# EasyEDA Pro project STM32F743ucosiii_lg.eprj, schematic 游戏主板_V2505
Board Name: 游戏主板_V2505; Create Date: 2025-06-09; Page Name: 游戏主板_V2505; Project Name: STM32F743ucosiii_lg; Schematic Name: 游戏主板_V2505; Update Date: 2025-06-09
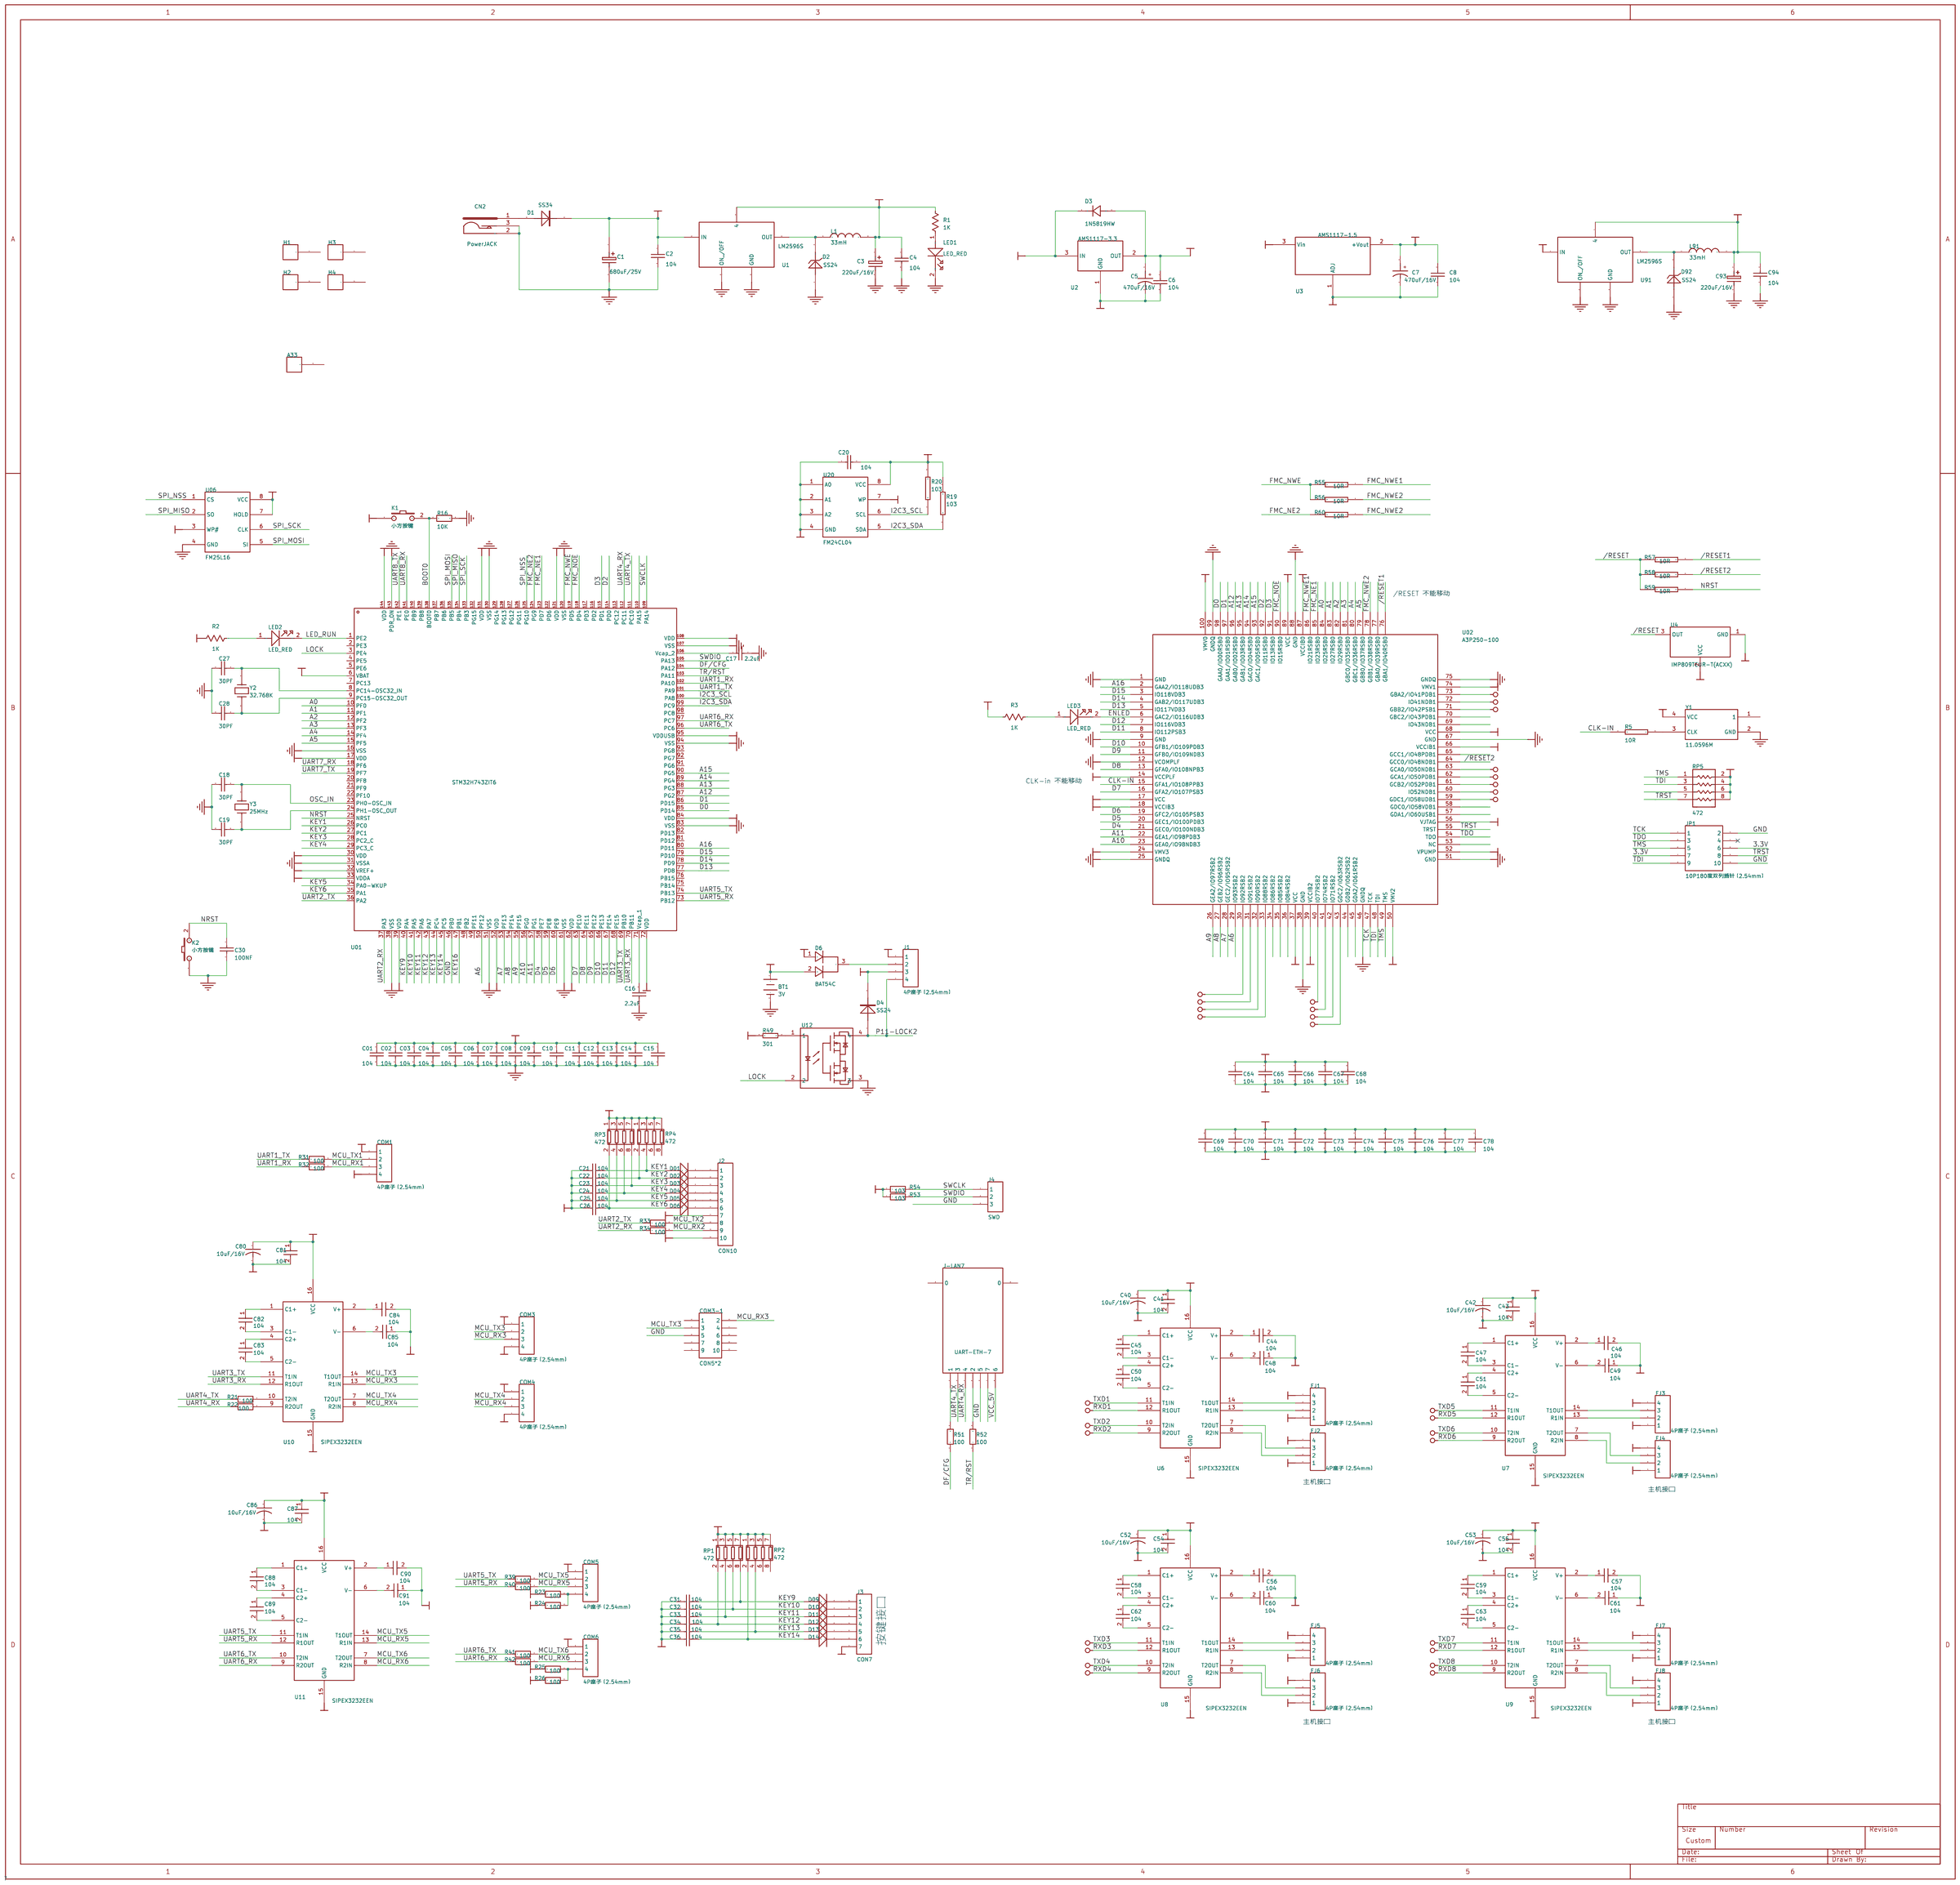
[diagram p0: schematic sheet]

## Parts
A33  TP  [A33安卓小板]
BT1  3V  [BATTERY_CR2032]
C01  104  [0805]
C1  680uF/25V  [EC_SMD_8*6]
C02  104  [0805]
C2  104  [0805]
C03  104  [0805]
C3  220uF/16V  [EC_SMD_8*6]
C04  104  [0805]
C4  104  [0805]
C5  470uF/16V  [EC_SMD_8*6]
C05  104  [0805]
C6  104  [C0805]
C06  104  [0805]
C7  470uF/16V  [EC_SMD_8*6]
C07  104  [0805]
C8  104  [C0805]
C08  104  [0805]
C09  104  [0805]
C10  104  [0805]
C11  104  [0805]
C12  104  [0805]
C13  104  [0805]
C14  104  [0805]
C15  104  [0805]
C16  2.2uF  [0805]
C17  2.2uF  [0805]
C18  30PF  [0805]
C19  30PF  [0805]
C20  104  [0805]
C21  104  [C0805]
C22  104  [C0805]
C23  104  [C0805]
C24  104  [C0805]
C25  104  [C0805]
C26  104  [C0805]
C27  30PF  [0805]
C28  30PF  [0805]
C30  100NF  [0805]
C31  104  [0805]
C32  104  [0805]
C33  104  [0805]
C34  104  [0805]
C35  104  [0805]
C36  104  [0805]
C40  10uF/16V  [EC_SMD_4*5.3]
C41  104  [C0805]
C42  10uF/16V  [EC_SMD_4*5.3]
C43  104  [C0805]
C44  104  [C0805]
C45  104  [C0805]
C46  104  [C0805]
C47  104  [C0805]
C48  104  [C0805]
C49  104  [C0805]
C50  104  [C0805]
C51  104  [C0805]
C52  10uF/16V  [EC_SMD_4*5.3]
C53  10uF/16V  [EC_SMD_4*5.3]
C54  104  [C0805]
C55  104  [C0805]
C56  104  [C0805]
C57  104  [C0805]
C58  104  [C0805]
C59  104  [C0805]
C60  104  [C0805]
C61  104  [C0805]
C62  104  [C0805]
C63  104  [C0805]
C64  104  [0805]
C65  104  [C0805]
C66  104  [C0805]
C67  104  [C0805]
C68  104  [C0805]
C69  104  [C0805]
C70  104  [C0805]
C71  104  [C0805]
C72  104  [C0805]
C73  104  [C0805]
C74  104  [C0805]
C75  104  [C0805]
C76  104  [C0805]
C77  104  [C0805]
C78  104  [C0805]
C80  10uF/16V  [EC_SMD_4*5.3]
C81  104  [0805]
C82  104  [0805]
C83  104  [0805]
C84  104  [0805]
C85  104  [0805]
C86  10uF/16V  [EC_SMD_4*5.3]
C87  104  [0805]
C88  104  [0805]
C89  104  [0805]
C90  104  [0805]
C91  104  [0805]
C93  220uF/16V  [EC_SMD_8*6]
C94  104  [0805]
CN2  PowerJACK  [POWER_DC12V]
COM1  4P座子（2.54mm）  [4SIP4]
COM3  4P座子（2.54mm）  [4SIP4]
COM3-1  CON5*2  [JYNJ_10]
COM4  4P座子（2.54mm）  [4SIP4]
COM5  4P座子（2.54mm）  [4SIP4]
COM6  4P座子（2.54mm）  [4SIP4]
D1  SS34  [SOD-1808]
D01  4148  [SOD-123]
D2  SS24  [SOD-1808]
D02  4148  [SOD-123]
D3  1N5819HW  [SOD-1808]
D03  4148  [SOD-123]
D04  4148  [SOD-123]
D4  SS24  [SOD-1808]
D05  4148  [SOD-123]
D06  4148  [SOD-123]
D6  BAT54C  [BAT54C]
D09  4148  [SOD-123]
D10  4148  [SOD-123]
D11  4148  [SOD-123]
D12  4148  [SOD-123]
D13  4148  [SOD-123]
D14  4148  [SOD-123]
D92  SS24  [SOD-1808]
FJ1  4P座子（2.54mm）  [4SIP4]
FJ2  4P座子（2.54mm）  [4SIP4]
FJ3  4P座子（2.54mm）  [4SIP4]
FJ4  4P座子（2.54mm）  [4SIP4]
FJ5  4P座子（2.54mm）  [4SIP4]
FJ6  4P座子（2.54mm）  [4SIP4]
FJ7  4P座子（2.54mm）  [4SIP4]
FJ8  4P座子（2.54mm）  [4SIP4]
H1  TP  [HOLE_6MM_3MM5]
H2  TP  [HOLE_6MM_3MM5]
H3  TP  [HOLE_6MM_3MM5]
H4  TP  [HOLE_6MM_3MM5]
J1  4P座子（2.54mm）  [4SIP4]
J2  CON10  [SIP10(2.54)]
J3  CON7  [SIP7(2.54)]
J4  SWD  [4SIP3]
J-LAN7  UART-ETH-7  [UART-ETH-7]
JP1  10P180度双列插针（2.54mm）  [JYNJ_10]
K1  小方按键  [4KEY-2]
K2  小方按键  [4KEY-2]
L1  33mH  [DG220]
L91  33mH  [DG220]
LED1  LED_RED  [LED-0805]
LED2  LED_RED  [LED-0805]
LED3  LED_RED  [LED-0805]
R1  1K  [0805]
R2  1K  [0805]
R3  1K  [0805]
R5  10R  [0805]
R16  10K  [0805]
R19  103  [0805]
R20  103  [0805]
R21  10K  [0805]
R22  10K  [0805]
R23  10K  [0805]
R24  10K  [0805]
R25  10K  [0805]
R26  10K  [0805]
R31  10K  [0805]
R32  10K  [0805]
R33  10K  [0805]
R34  10K  [0805]
R39  10K  [0805]
R40  10K  [0805]
R41  10K  [0805]
R42  10K  [0805]
R49  301  [0805]
R51  10K  [0805]
R52  10K  [0805]
R53  10K  [0805]
R54  10K  [0805]
R55  10R  [0805]
R56  10R  [0805]
R57  10R  [0805]
R58  10R  [0805]
R59  10R  [0805]
R60  10R  [0805]
RP1  472  [0603-8P4R]
RP2  472  [0603-8P4R]
RP3  472  [0603-8P4R]
RP4  472  [0603-8P4R]
RP5  472  [0603-8P4R]
U01  STM32H743ZIT6  [STM32H743-LQFP-144]
U1  LM2596S  [TO-263]
U02  A3P250-100  [A3P250-LQFP100]
U2  AMS1117-3.3  [LM1117-3.3]
U3  AMS1117-1.5  [LM1117-3.3]
U4  IMP809TEUR-T(ACXX)  [809T]
U6  SIPEX3232EEN  [SIPEX3232EEN]
U06  FM25L16  [SOIC-8_L5.3-W5.3-P1.27-LS8.0-BL]
U7  SIPEX3232EEN  [SIPEX3232EEN]
U8  SIPEX3232EEN  [SIPEX3232EEN]
U9  SIPEX3232EEN  [SIPEX3232EEN]
U10  SIPEX3232EEN  [SIPEX3232EEN]
U11  SIPEX3232EEN  [SIPEX3232EEN]
U12  GAQY211G2S  [固态继电器SOP-4]
U20  FM24CL04  [SO-8]
U91  LM2596S  [TO-263]
Y1  11.0596M  [OSC-SMD4P-11.0592M]
Y2  32.768K  [OSC-SMD2P-32.768K]
Y3  25MHz  [OSC-SMD2P_25M]

## Library data of the parts
A33 H1-H4 = TP: Library Name: *
BT1 = BATTERY: Library Name: A20_BOARD_V1
C01 = CAP: 贴片电容; Origin Footprint 3: CAP0805; Library Name: 常用
C1 = ELECTRO1: Electrolytic Capacitor; Library Name: *
C02 C03 C04 C05 C06 C07 C08 C09-C17 = CAP: 贴片电容; Origin Footprint 2: CAP0805; Origin Footprint 3: C0805; Library Name: 常用
C2 C4 C20 C94 = CAP: 电容; Origin Footprint 2: RAD0.2; Library Name: *
C3 C93 = ELECTRO1: 电解电容; Origin Footprint 2: RB-.1/.2; Library Name: *
C5 C7 = CAPACITOR POL: Library Name: A20_BOARD_V1
C6 C8 = CAP: Capacitor; Origin Footprint 2: 0805; Origin Footprint 3: CAP0805; Library Name: A20_BOARD_V1
C18 C19 C27 C28 C30 = CAP: Capacitor; Origin Footprint 2: 0603; Origin Footprint 3: 0402; Library Name: *
C21-C26 C65-C78 = CAP: Capacitor; Origin Footprint 2: 0805; Origin Footprint 3: CAP0805; Library Name: *
C31-C36 C64 = CAP: Capacitor; Origin Footprint 2: CAP0805; Origin Footprint 3: C0805; Library Name: *
C40 C42 C52 C53 C80 C86 = CAP_1: Text Field1: 20; Text Field2: 10; Origin Footprint 2: RB-.1/.2; Origin Footprint 3: RB-.1/.2; Library Name: COM
C41 C43 C45 C47 C50 C51 C54 C55 C58 C59 C62 C63 = CAP NP_2: Text Field1: 20; Text Field2: 10; Origin Footprint 2: 0805; Origin Footprint 3: CAP0805; Library Name: *
C44 C46 C48 C49 C56 C57 C60 C61 = CAP NP_1: Text Field1: 20; Text Field2: 10; Origin Footprint 2: 0805; Origin Footprint 3: CAP0805; Library Name: *
C81-C83 C87-C89 = CAP NP_2: Text Field1: 20; Text Field2: 10; Origin Footprint 2: CAP0805; Origin Footprint 3: C0805; Library Name: *
C84 C85 C90 C91 = CAP NP_1: Text Field1: 20; Text Field2: 10; Origin Footprint 2: CAP0805; Origin Footprint 3: C0805; Library Name: *
CN2 = PowerJACK: Library Name: A20_BOARD_V1
COM1 COM3-COM6 FJ1-FJ8 J1 = CON4: Connector; Library Name: *
COM3-1 = CON5*2: 10P180度插座（2.54mm）; Library Name: XXLG
D1 D4 = DIODE: 二极管; Origin Footprint 2: DIODE0.3; Origin Footprint 3: DIODE0.4; Origin Footprint 4: DIODE0.7; Library Name: *
D01 D02 D03 D04 D05 D06 D09-D14 = Diode 1N4148: High Conductance Fast Diode; Published: 8-Jun-2000; LatestRevisionDate: 17-Jul-2002; LatestRevisionNote: Re-released for DXP Platform.; DatasheetDocument: 1997; PackageReference: DO-35; Publisher: Altium Limited; Code_JEDEC: DO-204-AH; ComponentLink1Description: Manufacturer Link; ComponentLink1URL: http://www.fairchildsemi.com/; ComponentLink2Description: Datasheet; ComponentLink2URL: http://www.fairchildsemi.com/ds/1N%2F1N4148.pdf; Library Name: Miscellaneous Devices; Datasheet: http://www.fairchildsemi.com/ds/1N%2F1N4148.pdf
D2 D92 = ZENER3: Zener Diode; Library Name: *
D3 = DIODE: Library Name: A20_BOARD_V1
D6 = BAT54C_C2135: Supplier Part: C2135; Supplier Footprint: SOT-23; JLCPCB Part Class: Extended Part; Datasheet: https://atta.szlcsc.com/upload/public/pdf/source/20140809/1457707206468.pdf; Supplier: LCSC; Forward Voltage (Vf@If): 1V@100mA; Reverse Voltage (Vr): 30V; Average Rectified Current (Io): 200mA; Library Name: XX_SWJX_1
J2 = CON10: 10P180度插座（2.54mm）; Library Name: XXLG
J3 = CON7: 10P180度插座（2.54mm）; Library Name: XXLG
J4 = CON3: Connector; Library Name: XXLG
J-LAN7 = UART-ETH_1: 8P串口转网口; Library Name: XXLG
JP1 = HEADER 5X2: Library Name: *
K1 K2 = SW-PB: 小方按键6*6; Library Name: 常用
L1 L91 = INDUCTOR: Library Name: *
LED1-LED3 = LED_0: Library Name: *
R1-R3 = R_Generic: P/N #1: CR10-1001F-T; TOL: 5%; VAL: 1R; REF: RC0603JR-071RL; FAB: YAGEO; DEV: R0603; DESIG: RC21 5%; BOI: 0603; Library Name: *
R5 R19 R20 R55-R60 = RES2: Library Name: *
R16 = Res2: Resistor; Published: 8-Jun-2000; LatestRevisionDate: 17-Jul-2002; LatestRevisionNote: Re-released for DXP Platform.; PackageReference: AXIAL-0.4; Publisher: Altium Limited; Origin Footprint 2: 0603; Origin Footprint 3: 0402; Library Name: Miscellaneous Devices
R21-R26 R31-R34 R39-R42 R53 R54 = Res2: Resistor; Published: 8-Jun-2000; LatestRevisionDate: 17-Jul-2002; LatestRevisionNote: Re-released for DXP Platform.; PackageReference: AXIAL-0.4; Publisher: Altium Limited; Origin Footprint 2: 0603; Origin Footprint 3: 0402; Design Item ID: RES2; Library Name: Miscellaneous Devices
R49 = R: Origin Footprint 2: AXIAL0.4; Origin Footprint 3: 1210; Origin Footprint 4: RES-1206; Origin Footprint 5: RES-0805; Library Name: XX_SWJX_1
R51 R52 = Res2: Resistor; Published: 8-Jun-2000; LatestRevisionDate: 17-Jul-2002; LatestRevisionNote: Re-released for DXP Platform.; PackageReference: AXIAL-0.4; Publisher: Altium Limited; Design Item ID: RES2; Library Name: Miscellaneous Devices
RP1-RP4 = RES4: Library Name: *
RP5 = RESPACK5: 贴片排阻; Library Name: 常用分立器件
U01 = STM32H743ZIT6: Supplier Part: C114408; Supplier Footprint: LQFP-144(20x20); JLCPCB Part Class: Extended Part; Datasheet: https://atta.szlcsc.com/upload/public/pdf/source/20180326/C129442_D4CD7A13251C79DE4F637D238512E0C6.pdf; Supplier: LCSC; Program Storage Size: 2MB; RAM Size: 1MB; GPIO Ports Number: 114; Operating Voltage Range: 1.62V~3.6V; CPU Maximum Speed: 480MHz; Program Memory Type: FLASH; ADC (Bit): 16bit; DAC (Bit): 12bit
U1 U91 = LM2596S: 电源芯片; Library Name: *
U02 = A3P250-100: Library Name: 常用IC
U2 = LM1117: Library Name: A20_BOARD_V1
U3 = LM117T: Origin Footprint 2: TO220H; Library Name: A20_BOARD_V1
U4 = IMP809: Library Name: 常用分立器件
U6-U11 = Sipex3232: Library Name: A20_pcb
U06 = FM25L16: Library Name: XX_SWJX_1
U12 = GAQY211G2S: Supplier Part: C7435104; Supplier Footprint: SOP-4; JLCPCB Part Class: Extended Part; Datasheet: https://atta.szlcsc.com/upload/public/pdf/source/20240823/3547E741FC2EB9AE5E041DA54A858D67.pdf; Supplier: LCSC; Input Forward Voltage: 1.2V; Voltage - Load: 40V; Continuous Load Current: 2.5A; Isolation Voltage(rms): 2.5kV; Turn-on time: 800us; Turn-off time: 20us; Library Name: XX_SWJX_1
U20 = 24C04: Library Name: *
Y1 = CRYSTAL1: X?; Library Name: *
Y2 Y3 = CRYSTAL: Crystal; Library Name: 常用分立器件

## Nets
1.5V: C7.1 C8.1 C64.2 C65.2 C66.1 C67.1 C68.1 U02.14(VCCPLF) U02.17(VCC) U02.37(VCC) U02.68(VCC) U02.89(VCC) U3.2(+Vout)
3.3V: C01.1 C02.1 C03.1 C04.1 C5.1 C05.1 C6.1 C06.1 C07.1 C08.1 C09.1 C10.1 C11.1 C12.1 C13.1 C14.1 C15.1 C20.2 C40.1 C41.1 C42.1 C43.1 C52.1 C53.1 C54.1 C55.1 C69.1 C70.1 C71.1 C72.1 C73.1 C74.1 C75.1 C76.1 C77.1 C78.1 C80.1 C81.1 C86.1 C87.1 D3.1(ANODE) D6.1(A1) JP1.6 JP1.7 K1.1 R2.1 R3.1 R19.2 R20.2 R49.2 R53.1 R54.1 RP1.1 RP1.3 RP1.5 RP1.7 RP2.1 RP2.3 RP2.5 RP2.7 RP3.1 RP3.3 RP3.5 RP3.7 RP4.1 RP4.3 RP4.5 RP4.7 RP5.2 RP5.4 RP5.6 RP5.8 U01.17(VDD) U01.30(VDD) U01.32(VREF+) U01.33(VDDA) U01.39(VDD) U01.52(VDD) U01.62(VDD) U01.72(VDD) U01.84(VDD) U01.95(VDDUSB) U01.108(VDD) U01.121(VDD) U01.131(VDD) U01.144(VDD) U2.2(OUT) U02.18(VCCIB3) U02.24(VMV3) U02.39(VCCIB2) U02.50(VMV2) U02.52(VPUMP) U02.56(VJTAG) U02.66(VCCIB1) U02.74(VMV1) U02.87(VCCIB0) U02.100(VMV0) U4.2(VCC) U06.3(WP#) U06.7(HOLD) U06.8(VCC) U6.16(VCC) U7.16(VCC) U8.16(VCC) U9.16(VCC) U10.16(VCC) U11.16(VCC) U20.8(VCC) Y1.4(VCC)
GND: BT1.2(-) C01.2 C1.2 C02.2 C2.2 C03.2 C3.2 C04.2 C4.2 C5.2 C05.2 C6.2 C06.2 C7.2 C07.2 C8.2 C08.2 C09.2 C10.2 C11.2 C12.2 C13.2 C14.2 C15.2 C16.2 C17.2 C18.1 C19.1 C20.1 C21.2 C22.2 C23.2 C24.2 C25.2 C26.2 C27.1 C28.1 C30.2 C31.2 C32.2 C33.2 C34.2 C35.2 C36.2 C40.2 C41.2 C42.2 C43.2 C44.2 C46.2 C48.1 C49.1 C52.2 C53.2 C54.2 C55.2 C56.2 C57.2 C60.1 C61.1 C64.1 C65.1 C66.2 C67.2 C68.2 C69.2 C70.2 C71.2 C72.2 C73.2 C74.2 C75.2 C76.2 C77.2 C78.2 C80.2 C81.2 C84.2 C85.1 C86.2 C87.2 C90.2 C91.1 C93.2 C94.2 CN2.2 CN2.3 COM1.1 COM3.1 COM3.4 COM3-1.5 COM4.1 COM4.4 COM5.1 COM6.1 D2.1(A) D92.1(A) FJ1.1 FJ1.4 FJ2.1 FJ2.4 FJ3.1 FJ3.4 FJ4.1 FJ4.4 FJ5.1 FJ5.4 FJ6.1 FJ6.4 FJ7.1 FJ7.4 FJ8.1 FJ8.4 J2.7 J3.7 J4.3 J-LAN7.5 JP1.2 JP1.10 K2.1 LED1.2(CATHODE) R16.2 R23.1 R25.1 U1.3(GND) U1.5(ON /OFF) U01.16(VSS) U01.31(VSSA) U01.38(VSS) U01.46(PB0) U01.51(VSS) U01.61(VSS) U01.83(VSS) U01.94(VSS) U01.107(VSS) U01.120(VSS) U01.130(VSS) U01.143(PDR_ON) U02.1(GND) U2.1(GND) U02.9(GND) U02.12(VCOMPLF) U02.25(GNDQ) U02.38(GND) U02.46(GNDQ) U02.51(GND) U02.67(GND) U02.75(GNDQ) U02.88(GND) U02.99(GNDQ) U3.1(ADJ) U4.1(GND) U06.4(GND) U6.15(GND) U7.15(GND) U8.15(GND) U9.15(GND) U10.15(GND) U11.15(GND) U12.3 U20.1(A0) U20.2(A1) U20.3(A2) U20.4(GND) U20.7(WP) U91.3(GND) U91.5(ON /OFF) Y1.2(GND)
V12: C1.1 C2.1 D1.2(K) D4.2(K) J1.3 U1.1(IN) U91.1(IN)
VCC_5V: C3.1 C4.1 D3.2(CATHODE) J2.10 J-LAN7.6 L1.2 R1.1 R24.1 R26.1 U1.4 U2.3(IN) U3.3(Vin)
/RESET: R57.1 R58.1 R59.1 U4.3(OUT)
/RESET1: R57.2 U02.76(GBA1/IO40RSB0)
/RESET2: R58.2 U02.64(GCC0/IO48NDB1)
A0: U01.10(PF0) U02.84(IO25RSB0)
A1: U01.11(PF1) U02.83(IO27RSB0)
A2: U01.12(PF2) U02.82(IO29RSB0)
A3: U01.13(PF3) U02.81(GBC0/IO35RSB0)
A4: U01.14(PF4) U02.80(GBC1/IO36RSB0)
A5: U01.15(PF5) U02.79(GBB0/IO37RSB0)
A6: U01.50(PF12) U02.29(IO93RSB2)
A7: U01.53(PF13) U02.28(GEC2/IO95RSB2)
A8: U01.54(PF14) U02.27(GEB2/IO96RSB2)
A9: U01.55(PF15) U02.26(GEA2/IO97RSB2)
A10: U01.56(PG0) U02.23(GEA0/IO98NDB3)
A11: U01.57(PG1) U02.22(GEA1/IO98PDB3)
A12: U01.87(PG2) U02.96(GAB0/IO02RSB0)
A13: U01.88(PG3) U02.95(GAB1/IO03RSB0)
A14: U01.89(PG4) U02.94(GAC0/IO04RSB0)
A15: U01.90(PG5) U02.93(GAC1/IO05RSB0)
A16: U01.80(PD11) U02.2(GAA2/IO118UDB3)
A33_5V: C93.1 C94.1 COM1.4 L91.2 U91.4
BOOT0: K1.2 R16.1 U01.138(BOOT0)
CLK-IN: R5.1 U02.15(GFA1/IO108PPB3)
D0: U01.85(PD14) U02.98(GAA0/IO00RSB0)
D1: U01.86(PD15) U02.97(GAA1/IO01RSB0)
D2: U01.114(PD0) U02.92(IO11RSB0)
D3: U01.115(PD1) U02.91(IO13RSB0)
D4: U01.58(PE7) U02.21(GEC0/IO100NDB3)
D5: U01.59(PE8) U02.20(GEC1/IO100PDB3)
D6: U01.60(PE9) U02.19(GFC2/IO105PSB3)
D7: U01.63(PE10) U02.16(GFA2/IO107PSB3)
D8: U01.64(PE11) U02.13(GFA0/IO108NPB3)
D9: U01.65(PE12) U02.11(GFB0/IO109NDB3)
D10: U01.66(PE13) U02.10(GFB1/IO109PDB3)
D11: U01.67(PE14) U02.8(IO112PSB3)
D12: U01.68(PE15) U02.7(IO116VDB3)
D13: U01.77(PD8) U02.5(IO117VDB3)
D14: U01.78(PD9) U02.4(GAB2/IO117UDB3)
D15: U01.79(PD10) U02.3(IO118VDB3)
DF/CFG: R51.1 U01.104(PA12)
ENLED: LED3.2(CATHODE) U02.6(GAC2/IO116UDB3)
FMC_NE1: U01.123(PD7) U02.85(IO23RSB0)
FMC_NE2: R60.1 U01.124(PG9)
FMC_NOE: U01.118(PD4) U02.90(IO15RSB0)
FMC_NWE: R55.1 R56.1 U01.119(PD5)
FMC_NWE1: R55.2 U02.86(IO21RSB0)
FMC_NWE2: R56.2 R60.2 U02.78(GBB1/IO38RSB0)
I2C3_SCL: R20.1 U01.100(PA8) U20.6(SCL)
I2C3_SDA: R19.1 U01.99(PC9) U20.5(SDA)
KEY1: C21.1 D01.1(2) RP4.4 U01.26(PC0)
KEY2: C22.1 D02.1(2) RP4.2 U01.27(PC1)
KEY3: C23.1 D03.1(2) RP3.8 U01.28(PC2_C)
KEY4: C24.1 D04.1(2) RP3.6 U01.29(PC3_C)
KEY5: C25.1 D05.1(2) RP3.4 U01.34(PA0-WKUP)
KEY6: C26.1 D06.1(2) RP3.2 U01.35(PA1)
KEY9: C31.1 D09.1(2) RP1.8 U01.40(PA4)
KEY10: C32.1 D10.1(2) RP1.6 U01.41(PA5)
KEY11: C33.1 D11.1(2) RP1.4 U01.42(PA6)
KEY12: C34.1 D12.1(2) RP1.2 U01.43(PA7)
KEY13: C35.1 D13.1(2) RP2.4 U01.44(PC4)
KEY14: C36.1 D14.1(2) RP2.2 U01.45(PC5)
KEY16: U01.47(PB1)
LED_RUN: LED2.2(CATHODE) U01.1(PE2)
LOCK: U01.3(PE4) U12.2
MCU_RX1: COM1.3 R32.2
MCU_RX2: J2.9 R34.2
MCU_RX3: COM3.3 COM3-1.2 U10.13(R1IN)
MCU_RX4: COM4.3 U10.8(R2IN)
MCU_RX5: COM5.3 R40.2 U11.13(R1IN)
MCU_RX6: COM6.3 R42.2 U11.8(R2IN)
MCU_TX1: COM1.2 R31.2
MCU_TX2: J2.8 R33.2
MCU_TX3: COM3.2 COM3-1.3 U10.14(T1OUT)
MCU_TX4: COM4.2 U10.7(T2OUT)
MCU_TX5: COM5.2 R39.2 U11.14(T1OUT)
MCU_TX6: COM6.2 R41.2 U11.7(T2OUT)
NRST: C30.1 K2.2 R59.2 U01.25(NRST)
OSC_IN: C18.2 U01.23(PH0-OSC_IN) Y3.2
P11-LOCK2: D4.1(A) J1.4 U12.4
RXD1: U02.30(IO92RSB2) U6.12(R1OUT)
RXD2: U02.33(IO88RSB2) U6.9(R2OUT)
RXD3: U02.59(GDC1/IO58UDB1) U8.12(R1OUT)
RXD4: U02.62(GCA1/IO50PDB1) U8.9(R2OUT)
RXD5: U02.40(IO77RSB2) U7.12(R1OUT)
RXD6: U02.43(GDC2/IO63RSB2) U7.9(R2OUT)
RXD7: U02.63(GCA0/IO50NDB1) U9.12(R1OUT)
RXD8: U02.73(GBA2/IO41PDB1) U9.9(R2OUT)
SPI_MISO: U01.134(PB4) U06.2(SO)
SPI_MOSI: U01.135(PB5) U06.5(SI)
SPI_NSS: U01.125(PG10) U06.1(CS)
SPI_SCK: U01.133(PB3) U06.6(CLK)
SWCLK: J4.1 R54.2 U01.109(PA14)
SWDIO: J4.2 R53.2 U01.105(PA13)
TCK: JP1.1 U02.47(TCK)
TDI: JP1.9 RP5.3 U02.48(TDI)
TDO: JP1.3 U02.54(TDO)
TMS: JP1.5 RP5.1 U02.49(TMS)
TR/RST: R52.1 U01.103(PA11)
TRST: JP1.8 RP5.7 U02.55(TRST)
TXD1: U02.31(IO91RSB2) U6.11(T1IN)
TXD2: U02.32(IO90RSB2) U6.10(T2IN)
TXD3: U02.60(IO52NDB1) U8.11(T1IN)
TXD4: U02.61(GCB2/IO52PDB1) U8.10(T2IN)
TXD5: U02.41(IO74RSB2) U7.11(T1IN)
TXD6: U02.42(IO71RSB2) U7.10(T2IN)
TXD7: U02.71(GBB2/IO42PSB1) U9.11(T1IN)
TXD8: U02.72(IO41NDB1) U9.10(T2IN)
UART1_RX: R32.1 U01.102(PA10)
UART1_TX: R31.1 U01.101(PA9)
UART2_RX: R34.1 U01.37(PA3)
UART2_TX: R33.1 U01.36(PA2)
UART3_RX: U01.70(PB11) U10.12(R1OUT)
UART3_TX: U01.69(PB10) U10.11(T1IN)
UART4_RX: J-LAN7.4 R22.1 U01.112(PC11)
UART4_TX: J-LAN7.3 R21.1 U01.111(PC10)
UART5_RX: R40.1 U01.73(PB12) U11.12(R1OUT)
UART5_TX: R39.1 U01.74(PB13) U11.11(T1IN)
UART6_RX: R42.1 U01.97(PC7) U11.9(R2OUT)
UART6_TX: R41.1 U01.96(PC6) U11.10(T2IN)
UART7_RX: U01.18(PF6)
UART7_TX: U01.19(PF7)
UART8_RX: U01.141(PE0)
UART8_TX: U01.142(PE1)
V-BAT: J1.1 U01.6(VBAT)
V-BT1: BT1.1(+) D6.2(A2)
NETC16_1: C16.1 U01.71(Vcap_1)
NETC17_1: C17.1 U01.106(Vcap_2)
NETC19_2: C19.2 U01.24(PH1-OSC_OUT) Y3.1
NETC27_2: C27.2 U01.8(PC14-OSC32_IN) Y2.2
NETC28_2: C28.2 U01.9(PC15-OSC32_OUT) Y2.1
NETC44_1: C44.1 U6.2(V+)
NETC45_1: C45.1 U6.1(C1+)
NETC45_2: C45.2 U6.3(C1-)
NETC46_1: C46.1 U7.2(V+)
NETC47_1: C47.1 U7.1(C1+)
NETC47_2: C47.2 U7.3(C1-)
NETC48_2: C48.2 U6.6(V-)
NETC49_2: C49.2 U7.6(V-)
NETC50_1: C50.1 U6.4(C2+)
NETC50_2: C50.2 U6.5(C2-)
NETC51_1: C51.1 U7.4(C2+)
NETC51_2: C51.2 U7.5(C2-)
NETC56_1: C56.1 U8.2(V+)
NETC57_1: C57.1 U9.2(V+)
NETC58_1: C58.1 U8.1(C1+)
NETC58_2: C58.2 U8.3(C1-)
NETC59_1: C59.1 U9.1(C1+)
NETC59_2: C59.2 U9.3(C1-)
NETC60_2: C60.2 U8.6(V-)
NETC61_2: C61.2 U9.6(V-)
NETC62_1: C62.1 U8.4(C2+)
NETC62_2: C62.2 U8.5(C2-)
NETC63_1: C63.1 U9.4(C2+)
NETC63_2: C63.2 U9.5(C2-)
NETC82_1: C82.1 U10.1(C1+)
NETC82_2: C82.2 U10.3(C1-)
NETC83_1: C83.1 U10.4(C2+)
NETC83_2: C83.2 U10.5(C2-)
NETC84_1: C84.1 U10.2(V+)
NETC85_2: C85.2 U10.6(V-)
NETC88_1: C88.1 U11.1(C1+)
NETC88_2: C88.2 U11.3(C1-)
NETC89_1: C89.1 U11.4(C2+)
NETC89_2: C89.2 U11.5(C2-)
NETC90_1: C90.1 U11.2(V+)
NETC91_2: C91.2 U11.6(V-)
NETCN2_1: CN2.1 D1.1(A)
NETCOM5_4: COM5.4 R23.2 R24.2
NETCOM6_4: COM6.4 R25.2 R26.2
NETD01_2: D01.2(1) J2.1
NETD2_2: D2.2(K) L1.1 U1.2(OUT)
NETD02_2: D02.2(1) J2.2
NETD03_2: D03.2(1) J2.3
NETD04_2: D04.2(1) J2.4
NETD05_2: D05.2(1) J2.5
NETD06_2: D06.2(1) J2.6
NETD6_3: D6.3(K) J1.2
NETD09_2: D09.2(1) J3.1
NETD10_2: D10.2(1) J3.2
NETD11_2: D11.2(1) J3.3
NETD12_2: D12.2(1) J3.4
NETD13_2: D13.2(1) J3.5
NETD14_2: D14.2(1) J3.6
NETD92_2: D92.2(K) L91.1 U91.2(OUT)
NETFJ1_2: FJ1.2 U6.13(R1IN)
NETFJ1_3: FJ1.3 U6.14(T1OUT)
NETFJ2_2: FJ2.2 U6.8(R2IN)
NETFJ2_3: FJ2.3 U6.7(T2OUT)
NETFJ3_2: FJ3.2 U7.13(R1IN)
NETFJ3_3: FJ3.3 U7.14(T1OUT)
NETFJ4_2: FJ4.2 U7.8(R2IN)
NETFJ4_3: FJ4.3 U7.7(T2OUT)
NETFJ5_2: FJ5.2 U8.13(R1IN)
NETFJ5_3: FJ5.3 U8.14(T1OUT)
NETFJ6_2: FJ6.2 U8.8(R2IN)
NETFJ6_3: FJ6.3 U8.7(T2OUT)
NETFJ7_2: FJ7.2 U9.13(R1IN)
NETFJ7_3: FJ7.3 U9.14(T1OUT)
NETFJ8_2: FJ8.2 U9.8(R2IN)
NETFJ8_3: FJ8.3 U9.7(T2OUT)
NETJ-LAN7_1: J-LAN7.1 R51.2
NETJ-LAN7_2: J-LAN7.2 R52.2
NETLED1_1: LED1.1(ANODE) R1.2
NETLED2_1: LED2.1(ANODE) R2.2
NETLED3_1: LED3.1(ANODE) R3.2
NETR5_2: R5.2 Y1.3(CLK)
NETR21_2: R21.2 U10.10(T2IN)
NETR22_2: R22.2 U10.9(R2OUT)
NETR49_1: R49.1 U12.1

Not connected (* = marked no-connect by the designer): A33 1; COM3-1 1 4 6 7 8 9 10; H1 1; H2 1; H3 1; H4 1; J-LAN7 0 7; JP1 4*; RP2 6 8; RP4 6 8; RP5 5; U01 2(PE3) 4(PE5) 5(PE6) 7(PC13) 20(PF8) 21(PF9) 22(PF10) 48(PB2) 49(PF11) 75(PB14) 76(PB15) 81(PD12) 82(PD13) 91(PG6) 92(PG7) 93(PG8) 98(PC8) 110(PA15) 113(PC12) 116(PD2) 117(PD3) 122(PD6) 126(PG11) 127(PG12) 128(PG13) 129(PG14) 132(PG15) 136(PB6) 137(PB7) 139(PB8) 140(PB9); U02 34(IO86RSB2) 35(IO85RSB2) 36(IO84RSB2) 44(GDB2/IO62RSB2) 45(GDA2/IO61RSB2) 53(NC) 57(GDA1/IO60USB1) 58(GDC0/IO58VDB1) 65(GCC1/IO48PDB1) 69(IO43NDB1) 70(GBC2/IO43PDB1) 77(GBA0/IO39RSB0); Y1 1

## Notes on the sheet
- /RESET 不能移动
- CLK-in 不能移动
- 主机接口
- 主机接口
- 按键接口
- 主机接口
- 主机接口
